# EAGLE design barbuddy_4layer (EAGLE 7.7.0)
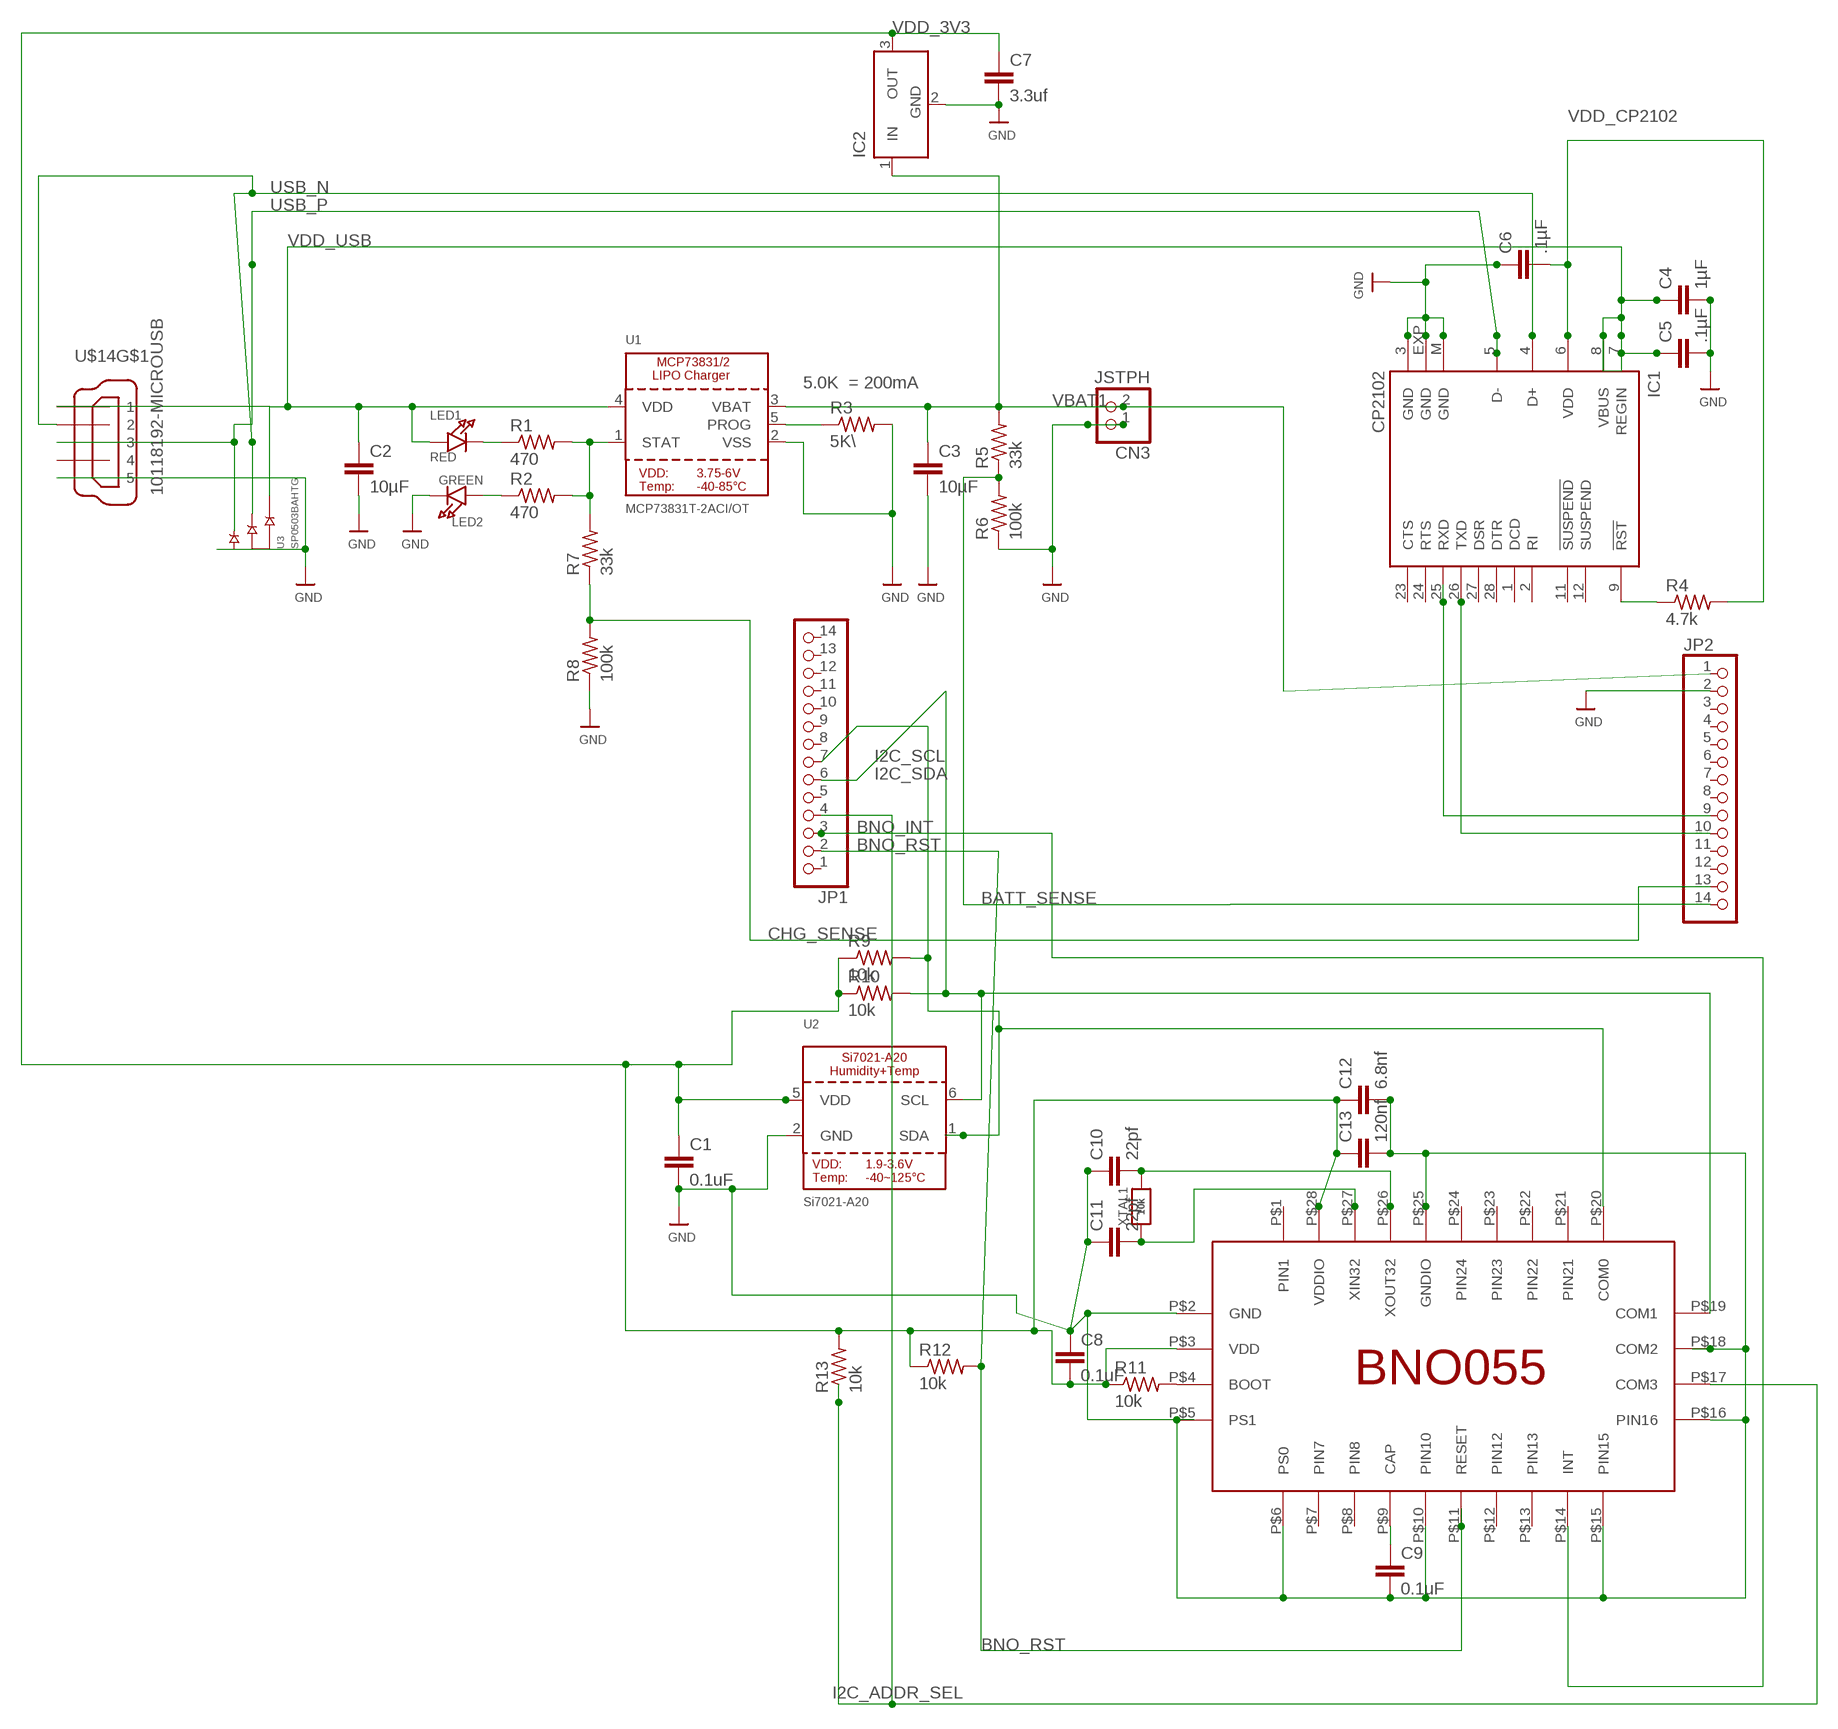
[diagram p0: schematic, sheet 1]

## Parts
BNO055  BNO055  [LGA-28]
C1  0.1uF  C-EUC0402  [C0402]
C2  10µF  C-EUC0402  [C0402]
C3  10µF  C-EUC0402  [C0402]
C4  1µF  C-EUC0402  [C0402]
C5  .1µF  C-EUC0402  [C0402]
C6  .1µF  C-EUC0402  [C0402]
C7  3.3uf  C-EUC0402  [C0402]
C8  0.1uF  C-EUC0402  [C0402]
C9  0.1uF  C-EUC0402  [C0402]
C10  22pf  C-EUC0402  [C0402]
C11  22pf  C-EUC0402  [C0402]
C12  6.8nf  C-EUC0402  [C0402]
C13  120nf  C-EUC0402  [C0402]
CN3  JSTPH  JST_2PIN  [JSTPH2]
IC1  CP2102  [MLP28]
IC2  LT1129CST5  [SOT223]
JP1  PINHD-1X14  [1X14]
JP2  PINHD-1X14  [1X14]
LED1  RED  LED0805_NOOUTLINE  [CHIPLED_0805_NOOUTLINE]
LED2  GREEN  LED0805_NOOUTLINE  [CHIPLED_0805_NOOUTLINE]
R1  470  R-US_R0402  [R0402]
R2  470  R-US_R0402  [R0402]
R3  5K\  R-US_R0402  [R0402]
R4  4.7k  R-US_R0402  [R0402]
R5  33k  R-US_R0402  [R0402]
R6  100k  R-US_R0402  [R0402]
R7  33k  R-US_R0402  [R0402]
R8  100k  R-US_R0402  [R0402]
R9  10k  R-US_R0402  [R0402]
R10  10k  R-US_R0402  [R0402]
R11  10k  R-US_R0402  [R0402]
R12  10k  R-US_R0402  [R0402]
R13  10k  R-US_R0402  [R0402]
U1  MCP73831T-2ACI/OT  MCP73831/2  [SOT23-5]
U2  Si7021-A20  SI7021-A20  [DFN6_3X3_SI]
U3  SP0503BAHTG  [SOT143]
U$14  10118192-MICROUSB  [MICROUSB-SMT]
XTAL1  10k  RESISTOR0805_NOOUTLINE  [0805-NO]

## Nets
BATT_SENSE: JP2.14 R5.1 R6.2
BNO_CAP: BNO055.P$9(CAP) C9.1
BNO_INT: BNO055.P$14(INT) JP1.3
BNO_RST: BNO055.P$11(RESET) JP1.2 R12.2
CHG_PROG: R3.1 U1.5(PROG)
CHG_SENSE: JP2.13 R7.1 R8.2
CHG_STATUS: R1.2 R2.2 R7.2 U1.1(STAT)
CP2102_RST: IC1.9(!RST) R4.1
GND: BNO055.P$2(GND) BNO055.P$5(PS1) BNO055.P$6(PS0) BNO055.P$10(PIN10) BNO055.P$15(PIN15) BNO055.P$16(PIN16) BNO055.P$18(COM2) BNO055.P$25(GNDIO) C1.2 C2.2 C3.2 C4.2 C5.2 C6.1 C7.2 C8.1 C9.2 C10.1 C11.1 C12.2 C13.2 CN3.1 IC1.3(GND) IC1.EXP(GND) IC1.M(GND) IC2.2(GND) JP2.2 LED2.C R3.2 R6.1 R8.1 U1.2(VSS) U2.2(GND) U3.1(GND) U$14.P$5
I2C_ADDR_SEL: BNO055.P$17(COM3) JP1.4 R13.1
I2C_SCL: BNO055.P$19(COM1) JP1.6 R10.2 U2.6(SCL)
I2C_SDA: BNO055.P$20(COM0) JP1.7 R9.2 U2.1(SDA)
N$1: LED1.C R1.1
N$3: BNO055.P$4(BOOT) R11.2
N$6: LED2.A R2.1
UART0_RX: IC1.26(TXD) JP2.10
UART0_TX: IC1.25(RXD) JP2.9
USB_N: IC1.4(D+) U3.3(B) U$14.P$2
USB_P: IC1.5(D-) U3.2(A) U$14.P$3
VBAT1: C3.1 CN3.2 IC2.1(IN) JP2.1 R5.2 U1.3(VBAT)
VDD_3V3: BNO055.P$3(VDD) BNO055.P$28(VDDIO) C1.1 C7.1 C8.2 C12.1 C13.1 IC2.3(OUT) R9.1 R10.1 R11.1 R12.1 R13.2 U2.5(VDD)
VDD_CP2102: C6.2 IC1.6(VDD) R4.2
VDD_USB: C2.1 C4.1 C5.1 IC1.7(REGIN) IC1.8(VBUS) LED1.A U1.4(VDD) U3.4(C) U$14.P$1
X_IN: BNO055.P$27(XIN32) C11.2 XTAL1.1
X_OUT: BNO055.P$26(XOUT32) C10.2 XTAL1.2
Unconnected: BNO055.P$1(PIN1) BNO055.P$7(PIN7) BNO055.P$8(PIN8) BNO055.P$12(PIN12) BNO055.P$13(PIN13) BNO055.P$21(PIN21) BNO055.P$22(PIN22) BNO055.P$23(PIN23) BNO055.P$24(PIN24) IC1.1(DCD) IC1.2(RI) IC1.11(!SUSPEND) IC1.12(SUSPEND) IC1.23(CTS) IC1.24(RTS) IC1.27(DSR) IC1.28(DTR) JP1.1 JP1.5 JP1.8 JP1.9 JP1.10 JP1.11 JP1.12 JP1.13 JP1.14 JP2.3 JP2.4 JP2.5 JP2.6 JP2.7 JP2.8 JP2.11 JP2.12 U$14.P$4 U$14.SHLD@0(S4) U$14.SHLD@1(S4) U$14.SHLD@2(S4) U$14.SHLD@3(S4) U$14.SHLD@4(S4) U$14.SHLD@5(S4)

## Notes on the sheet
- 5.0K  = 200mA

## Power pins joined to a net without a drawn wire
GND: IC2.4(GND)

## Library data of the parts
BNO055 = BNO055:BNO055
C1-C13 = rcl:C-EU: CAPACITOR, European symbol
CN3 = microbuilder:JST_2PIN: JST 2-Pin Right-Angle Connector PH-Series - 4UConnector: 17311 SH-Series - 4UConnector: 07278
IC1 = silabs:CP210*: Single-Chip USB to UART Bridge Source: www.silabs.com .. CP2101.pdf / cp2102.pdf; MF: FARNELL; MPN: CP2102-GM; OC_FARNELL: 9282130; OC_NEWARK: 30K5635
IC2 = linear-technology:LT1129CST5: VOLTAGE REGULATOR with shutdown
JP1 JP2 = pinhead:PINHD-1X14: PIN HEADER
LED1 LED2 = microbuilder:LED: LED 0603 - 0603 Surface Mount Package 2mA: Green LED - Low Power (3.9mcd, 2ma, 1.7Vf) - Digikey: 475-2709-2-ND Orange LED - Low Power (9.8mcd, 2ma, 1.8Vf) - Digikey: 475-1194-2-ND Red LED - Low Power (5mcd, 2ma, 1.8Vf) - Digikey: 475-1195-2-ND Yellow LED - Low Power (7mcd, 2ma, 1.8Vf) - Digikey: 475-1196-2-ND 5mA: Blue LED - Low Power (17mcd, 5ma, 2.9Vf) - Digikey: LNJ937W8CRACT-ND 0805 - 0805 Surface Mount Package 2mA: Red LED (8.8mcd, 2mA, 1.8Vf, Clear) - Low Power [Digikey: 475-2510-1-ND] Green LED (5mcd, 2mA, 1.8Vf, Clear) - Low Power [Digikey: 475-2730-1-ND] Yellow LED (11.3mcd, 2mA, 1.8Vf, Clear) - Low Power [Digikey: 475-2555-1-ND] 20mA: Red LED (104mcd, 20mA, Diffused) - LS R976 [Digikey: 475-1278-6-ND] Red LED (12mcd, 20mA, 2.0Vf, Clear) - APT2012EC [Digikey: 754-1128-1-ND] Green LED (15mcd, 20mA, 2.2Vf, Clear) - APT2012GC [Digikey: 754-1131-1-ND] Orange LED (160mcd, 20mA, 2.1Vf, Clear) - APT2012SECK [Digikey: 754-1130-1-ND] 1206 - 1206 Surface Mount Package Green LED (26mcd, 20mA, Diffused) - LG N971 [Digikey: 475-1407-6-ND] Red LED (15mcd, 20mA, Diffused) - LH N974 [Digikey: 475-1416-6-ND] Cree - Cree High-Power Surface Mount LEDs XPEBWT-L1-0000-00D50 - White 111lm 350mA 2.9Vf 6200K 110° XTEAWT-00-0000-00000LEE3 - White 114lm 350mA 2.85Vf 5000K 115° Everlight - Everlight 45-21 Series Surface Mount LEDs 45-21/QK2C-B2832AC2CB2/2T - Warm White 2000mcd 20mA 3.25Vf 3050K 120° 45-21/LK2C-B38452C4CB2/2T - Nuetral White 2000mcd 20mA 3.25Vf 4150K 120° 45-21/LK2C-B50634C6CB2/2T - Cold White 2200mcd 20mA 3.25Vf 5650K 120° PLCC2 Reverse Mount LS T77K-J1L2-1-0-2-R18-Z - Red 11.25mcd 2mA 1.8Vf 630nm 120° LO T77K-L1M2-24-Z - Orange 19.6mcd 2mA 1.8Vf 606nm 120° LY T77K-K2M1-26-Z - Yellow 15.7mcd 2mA 1.8Vf 587nm 120°
R1-R13 = rcl:R-US_: RESISTOR, American symbol
U1 = microbuilder:MCP73831/2: MCP73831/2 LIPO Charger VDD: 3.75 - 6V Temp -40 - 85°C Programmable Charge Rate: 15-500mA NOTE: STAT is a tri-state logic output on the MCP73831 and an open-drain output on the MCP73832. SOT23-5 with 4.2V output and tri-state logic on STAT = MCP73831T-2ACI/OT
U2 = microbuilder:SI7021-A20: Si7021-A20 - I2C Humidity and Temperature Sensor VDD: 1.9-3.6V Operating Temperature: -40~125°C +/-3% RH (max) 0..80% RH Humidity Sensor +/-0.4°C (max-, -10~85°C Temperature Sensor 150uA Active, 60nA Standby
U3 = littlefuse:SP0503BAHTG
U$14 = FCI-10118192-microusb:10118192-MICROUSB
XTAL1 = microbuilder:RESISTOR: Resistors For new designs, use the packages preceded by an '_' character since they are more reliable: The following footprints should be used on most boards: _0402 - Standard footprint for regular board layouts _0603 - Standard footprint for regular board layouts _0805 - Standard footprint for regular board layouts _1206 - Standard footprint for regular board layouts For extremely tight-pitch boards where space is at a premium, the following 'micro-pitch' footprints can be used (smaller pads, no silkscreen outline, etc.): _0402MP - Micro-pitch footprint for very dense/compact boards _0603MP - Micro-pitch footprint for very dense/compact boards _0805MP - Micro-pitch footprint for very dense/compact boards _1206MP - Micro-pitch footprint for very dense/compact boards

## Board
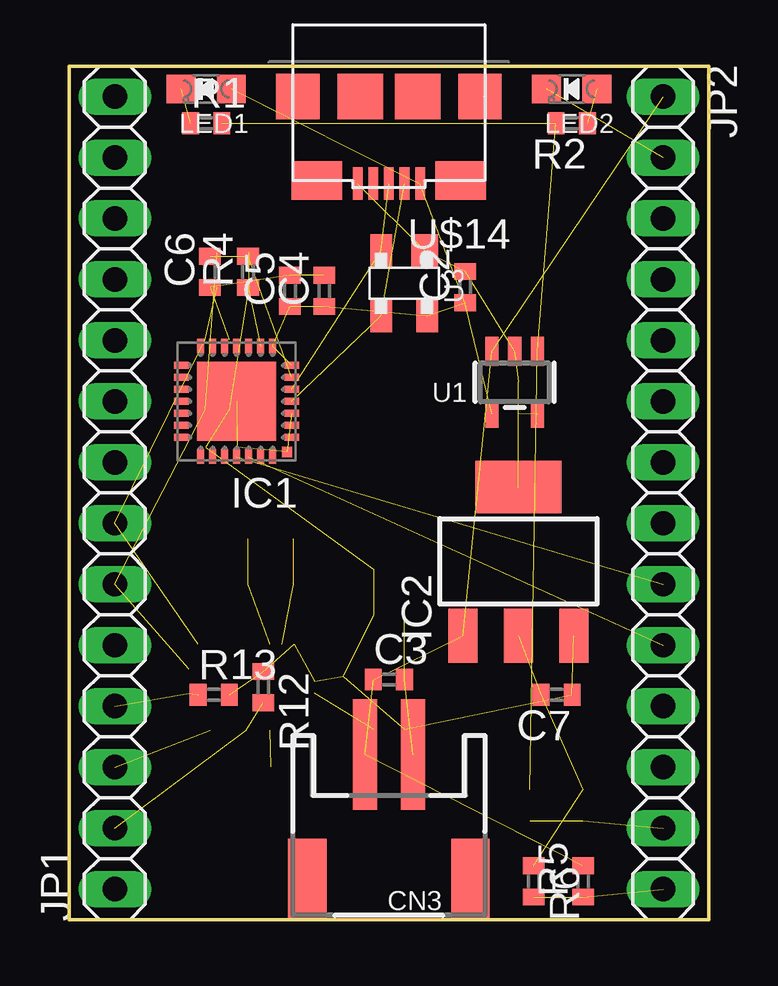
[diagram p1: board, top side]
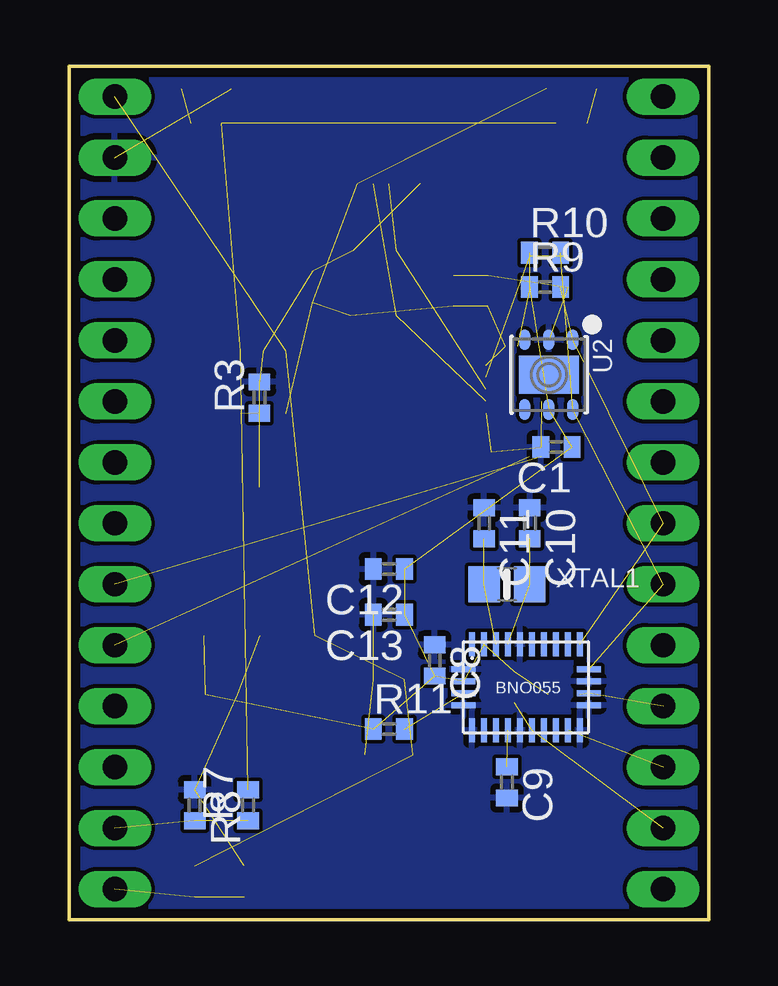
[diagram p2: board, bottom side, seen from below]

Size 26.67 x 35.56 mm. Coordinates in mm from the lower left corner, seen from the top.
Outline: 0,0 0,35.56 26.67,35.56 26.67,0 0,0
Copper layers (1*2*15*16): Top 0.035559375mm / dielectric 8mil / $GND 0.035559375mm / dielectric 40mil / layer 15 0.035559375mm / dielectric 8mil / Bottom 0.0356mm
Design rules "LaenPCBOrder *": minimum track width 6mil, minimum drill 13mil, track to track 6mil, track to pad 6mil, pad to pad 6mil, via to via 6mil, smd to smd 6mil, copper to edge 15mil, drill to drill 6mil, minimum pad ring 7mil, minimum via ring 7mil, stop-mask expansion 3mil, vias tented up to drill 0mil, thermal gap 10mil

### Footprints (pad centres in the part's own frame; a part is rotated, then mirrored left to right if it is on the bottom)
LGA-28 = smd 0.25 x 1: P$1 -2.25,1.787; P$6 -2.25,-1.787; P$7 -1.75,-1.787; P$8 -1.25,-1.787; P$9 -0.75,-1.787; P$10 -0.25,-1.787; P$11 0.25,-1.787; P$12 0.75,-1.787; P$13 1.25,-1.787; P$14 1.75,-1.787; P$15 2.25,-1.787; P$20 2.25,1.787; P$21 1.75,1.787; P$22 1.25,1.787; P$23 0.75,1.787; P$24 0.25,1.787; P$25 -0.25,1.787; P$26 -0.75,1.787; P$27 -1.25,1.787; P$28 -1.75,1.787 | smd 1 x 0.25: P$2 -2.612,0.75; P$3 -2.612,0.25; P$4 -2.612,-0.25; P$5 -2.612,-0.75; P$16 2.612,-0.75; P$17 2.612,-0.25; P$18 2.612,0.25; P$19 2.612,0.75
C0402 = smd 0.7 x 0.9: 1 -0.65,0; 2 0.65,0
JSTPH2 = smd 1 x 4.6: 1 -1,-3.7; 2 1,-3.7 | smd 1.6 x 3.4: NC1 -3.4,1.5; NC2 3.4,1.5
MLP28 = smd 0.6 x 0.3: 1 -2.3,1.5; 2 -2.3,1; 3 -2.3,0.5; 4 -2.3,0; 5 -2.3,-0.5; 6 -2.3,-1; 7 -2.3,-1.5; 15 2.3,-1.5; 16 2.3,-1; 17 2.3,-0.5; 18 2.3,0; 19 2.3,0.5; 20 2.3,1; 21 2.3,1.5 | smd 0.3 x 0.6: 8 -1.5,-2.3; 9 -1,-2.3; 10 -0.5,-2.3; 11 0,-2.3; 12 0.5,-2.3; 13 1,-2.3; 14 1.5,-2.3; 22 1.5,2.3; 23 1,2.3; 24 0.5,2.3; 25 0,2.3; 26 -0.5,2.3; 27 -1,2.3; 28 -1.5,2.3 | smd 3.3 x 3.3: EXP 0,0 | smd 0.435 x 0.435: M -2.103,2.103
SOT223 = smd 1.219 x 2.235: 1 -2.311,-3.099; 2 0,-3.099; 3 2.311,-3.099 | smd 3.6 x 2.2: 4 0,3.099
1X14 = drill 1.016 long: 1 -16.51,0; 2 -13.97,0; 3 -11.43,0; 4 -8.89,0; 5 -6.35,0; 6 -3.81,0; 7 -1.27,0; 8 1.27,0; 9 3.81,0; 10 6.35,0; 11 8.89,0; 12 11.43,0; 13 13.97,0; 14 16.51,0
CHIPLED_0805_NOOUTLINE = smd 1.2 x 1.2: A 0,-1.05; C 0,1.05
R0402 = smd 0.7 x 0.9: 1 -0.65,0; 2 0.65,0
SOT23-5 = smd 0.55 x 1.2: 1 -0.95,-1.3; 2 0,-1.3; 3 0.95,-1.3; 4 0.95,1.3; 5 -0.95,1.3
DFN6_3X3_SI = smd 0.85 x 0.45: 1 -1.45,1; 2 -1.45,0; 3 -1.45,-1; 4 1.45,-1; 5 1.45,0; 6 1.45,1 | smd 1.6 x 2.5: P$1 0,0
SOT143 = smd 1.4 x 1.1: 1 -1.35,0.86 | smd 1.4 x 0.9: 2 -1.35,-0.96; 3 1.35,-0.96; 4 1.35,0.96
MICROUSB-SMT = smd 0.4 x 1.35: P$1 -1.3,3.625; P$2 -0.65,3.625; P$3 0,3.625; P$4 0.65,3.625; P$5 1.3,3.625 | smd 2.1 x 1.6: SHLD@0 -3,3.5; SHLD@1 3,3.5 | smd 1.8 x 1.9: SHLD@2 -3.8,0; SHLD@5 3.8,0 | smd 1.9 x 1.9: SHLD@3 -1.2,0; SHLD@4 1.2,0
0805-NO = smd 1.3 x 1.5: 1 -0.95,0; 2 0.95,0

### Placement (x,y rotation side)
BNO055  7.62,9.68 0 bottom
C1  6.35,19.68 180 bottom
C2  16.51,26.35 90 top
C3  13.34,10 0 top
C4  10.64,26.19 90 top
C5  9.21,26.19 90 top
C6  5.87,26.99 90 top
C7  20.32,9.37 180 top
C8  11.43,10.79 270 bottom
C9  8.41,5.71 270 bottom
C10  7.46,16.51 270 bottom
C11  9.37,16.51 270 bottom
C12  13.34,14.61 180 bottom
C13  13.34,12.7 180 bottom
CN3  13.34,3.17 180 top
IC1  6.99,21.59 180 top
IC2  18.73,14.92 0 top
JP1  1.91,17.78 90 top
JP2  24.77,17.78 270 top
LED1  5.71,34.61 90 top
LED2  20.95,34.61 90 top
R1  5.71,33.18 0 top
R2  20.95,33.18 180 top
R3  18.73,21.75 90 bottom
R4  7.46,26.99 90 top
R5  21.43,1.59 90 top
R6  19.37,1.59 270 top
R7  19.21,4.76 90 bottom
R8  21.43,4.76 270 bottom
R9  6.83,26.35 0 bottom
R10  6.83,27.78 0 bottom
R11  13.34,7.94 0 bottom
R12  8.1,9.68 270 top
R13  6.03,9.37 0 top
U1  18.57,22.38 180 top
U2  6.67,22.7 270 bottom
U3  13.97,26.51 270 top
U$14  13.34,34.29 180 top
XTAL1  8.41,13.97 0 bottom

### Tracks (layer width: path | path; a pad name or v marks a point on that pad's centre or on a via)
BATT_SENSE  (2 unrouted)
BNO_CAP  (1 unrouted)
BNO_INT  (1 unrouted)
BNO_RST  (2 unrouted)
CHG_PROG  (1 unrouted)
CHG_SENSE  (2 unrouted)
CHG_STATUS  (3 unrouted)
CP2102_RST  (1 unrouted)
GND  (17 unrouted)
  pour Bottom: 0,35.56 0,0 26.67,0 26.67,35.56
I2C_ADDR_SEL  (2 unrouted)
I2C_SCL  (3 unrouted)
I2C_SDA  (3 unrouted)
N$1  (1 unrouted)
N$3  (1 unrouted)
N$6  (1 unrouted)
UART0_RX  (1 unrouted)
UART0_TX  (1 unrouted)
USB_N  (2 unrouted)
USB_P  (2 unrouted)
VBAT1  (5 unrouted)
VDD_3V3  (13 unrouted)
VDD_CP2102  (2 unrouted)
VDD_USB  (8 unrouted)
X_IN  (2 unrouted)
X_OUT  (2 unrouted)